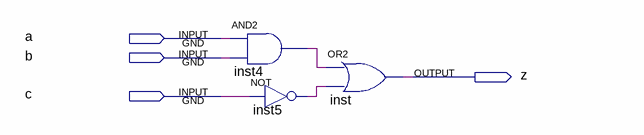
[diagram p0: schematic sheet]
// Quartus schematic 2-4.bdf as structural Verilog: 3 symbols, 4 pins
module \2-4  (
  input  a,
  input  b,
  input  c,
  output z
);

  wire inst4_out, inst5_out;

  and inst4 (inst4_out, a, b);
  not inst5 (inst5_out, c);
  or inst (z, inst4_out, inst5_out);
endmodule
